# EAGLE board Jonah-ar PANEL - LCD-midi (EAGLE 6.4), part 1 of 2
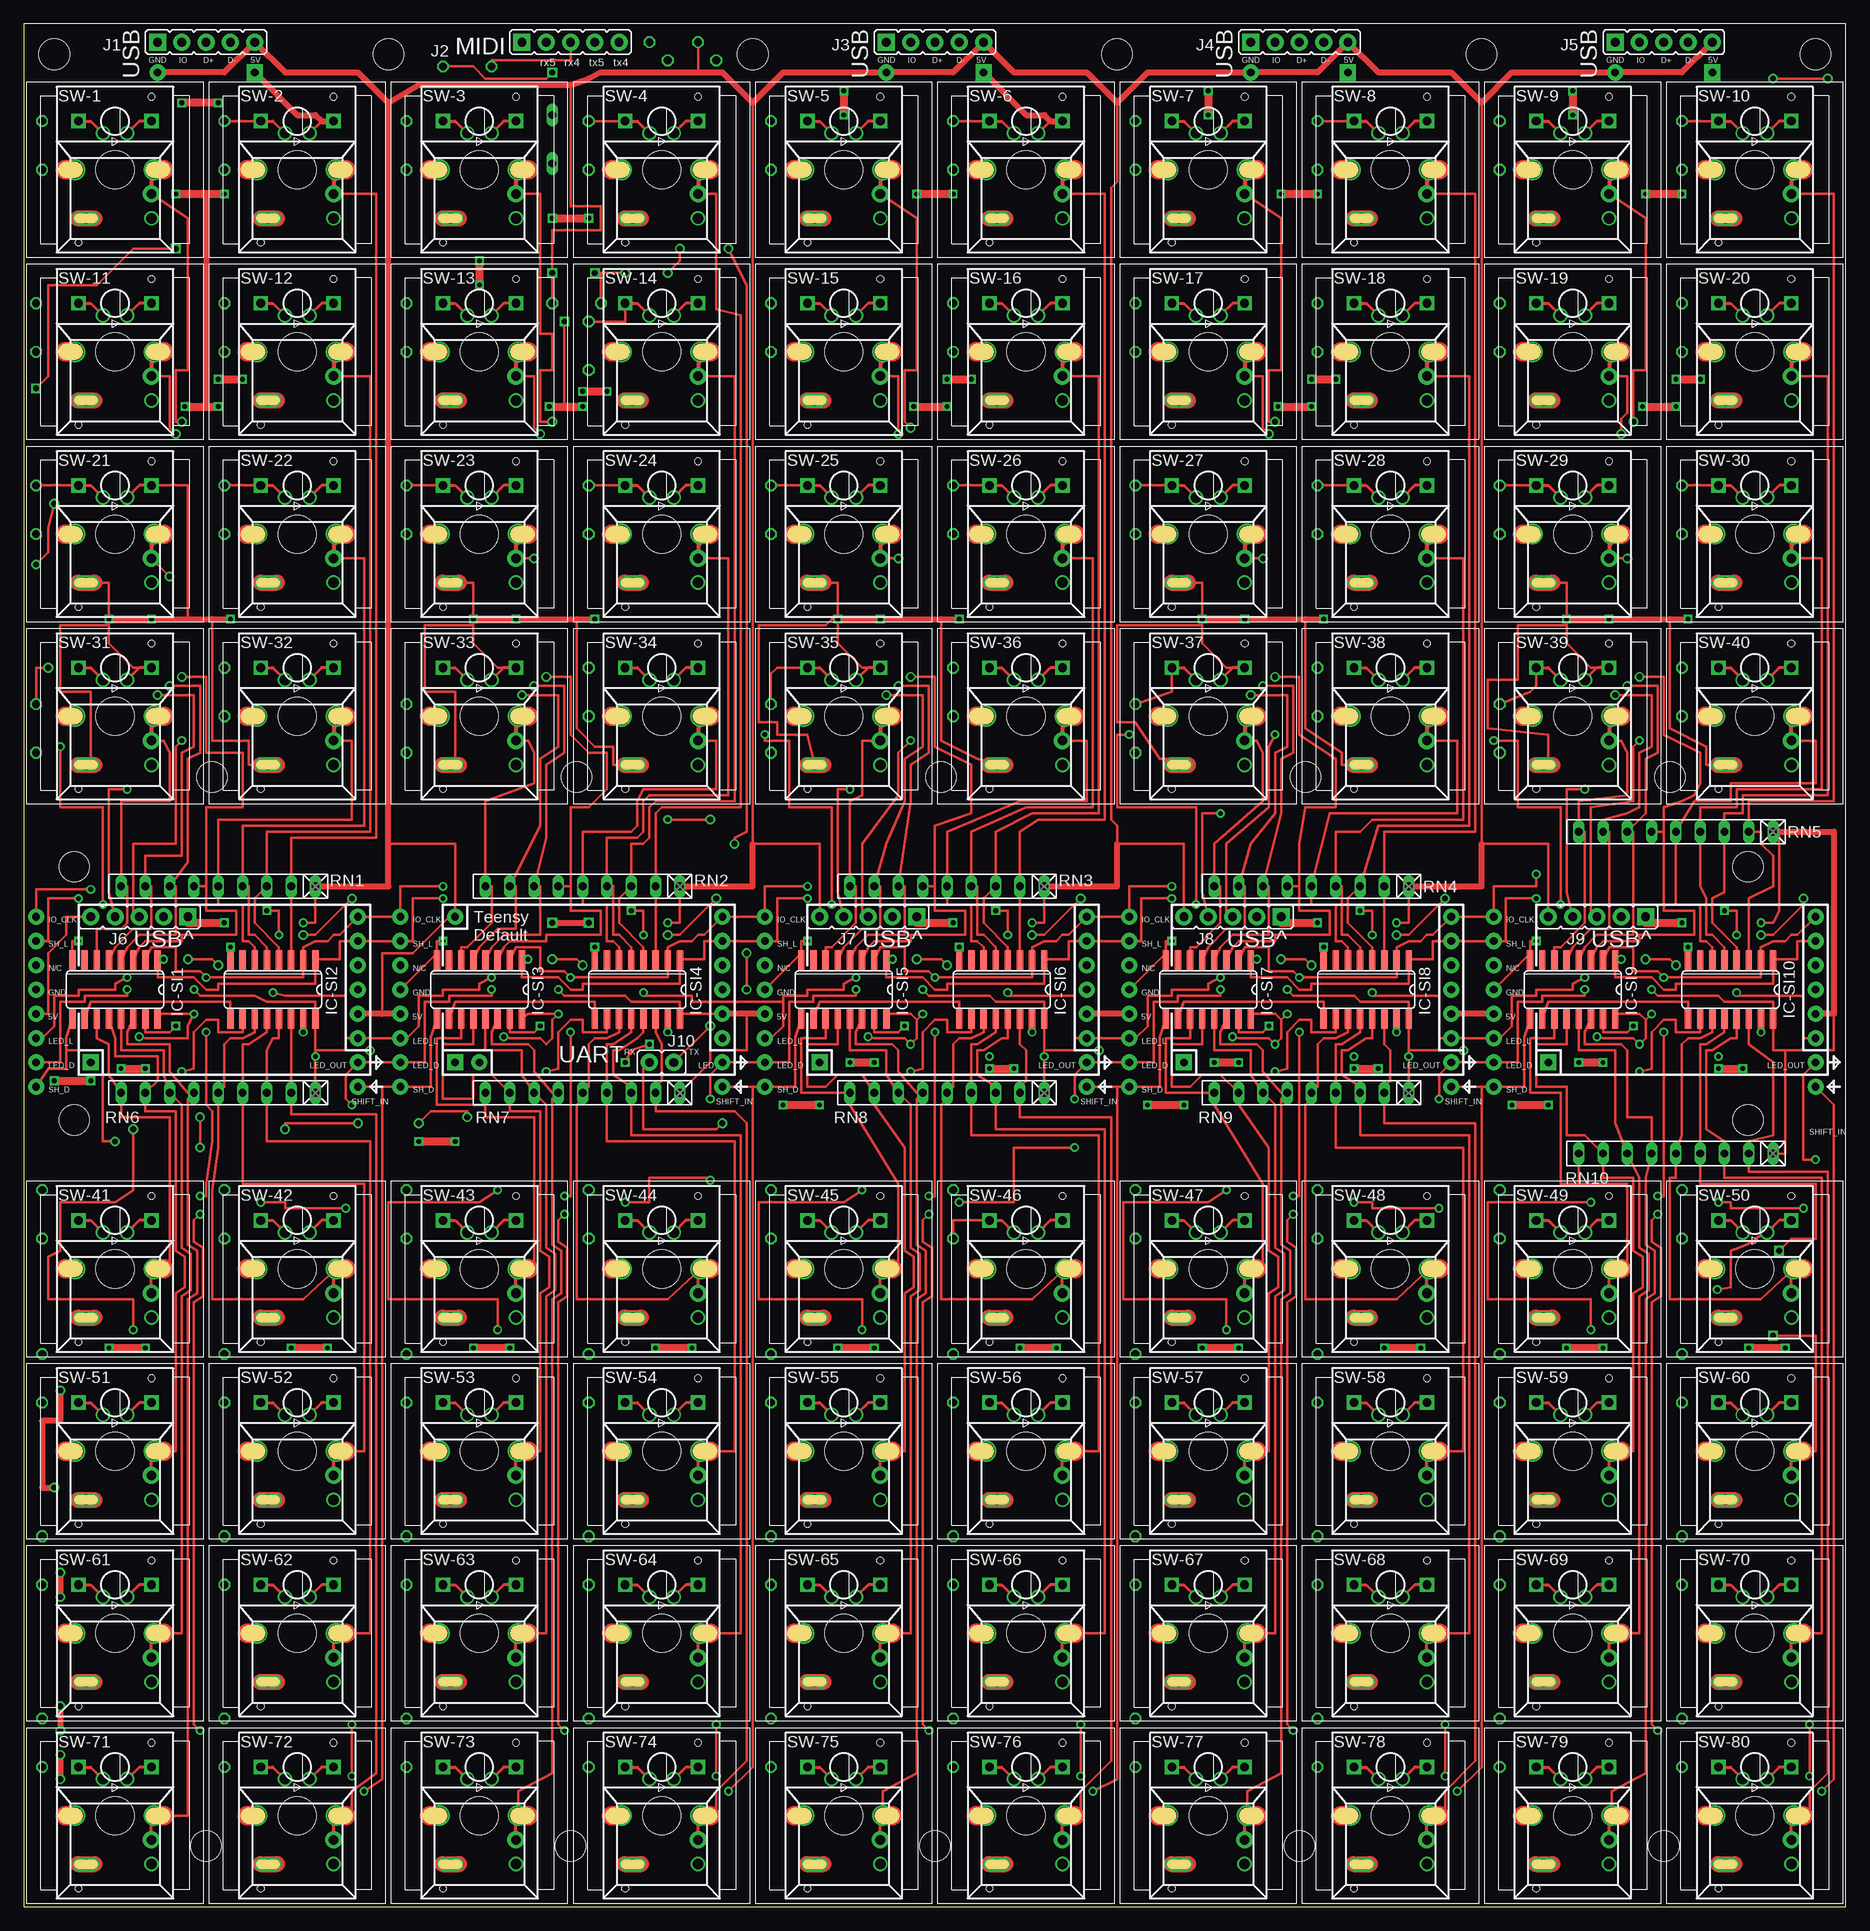
[diagram p4: board, top side]
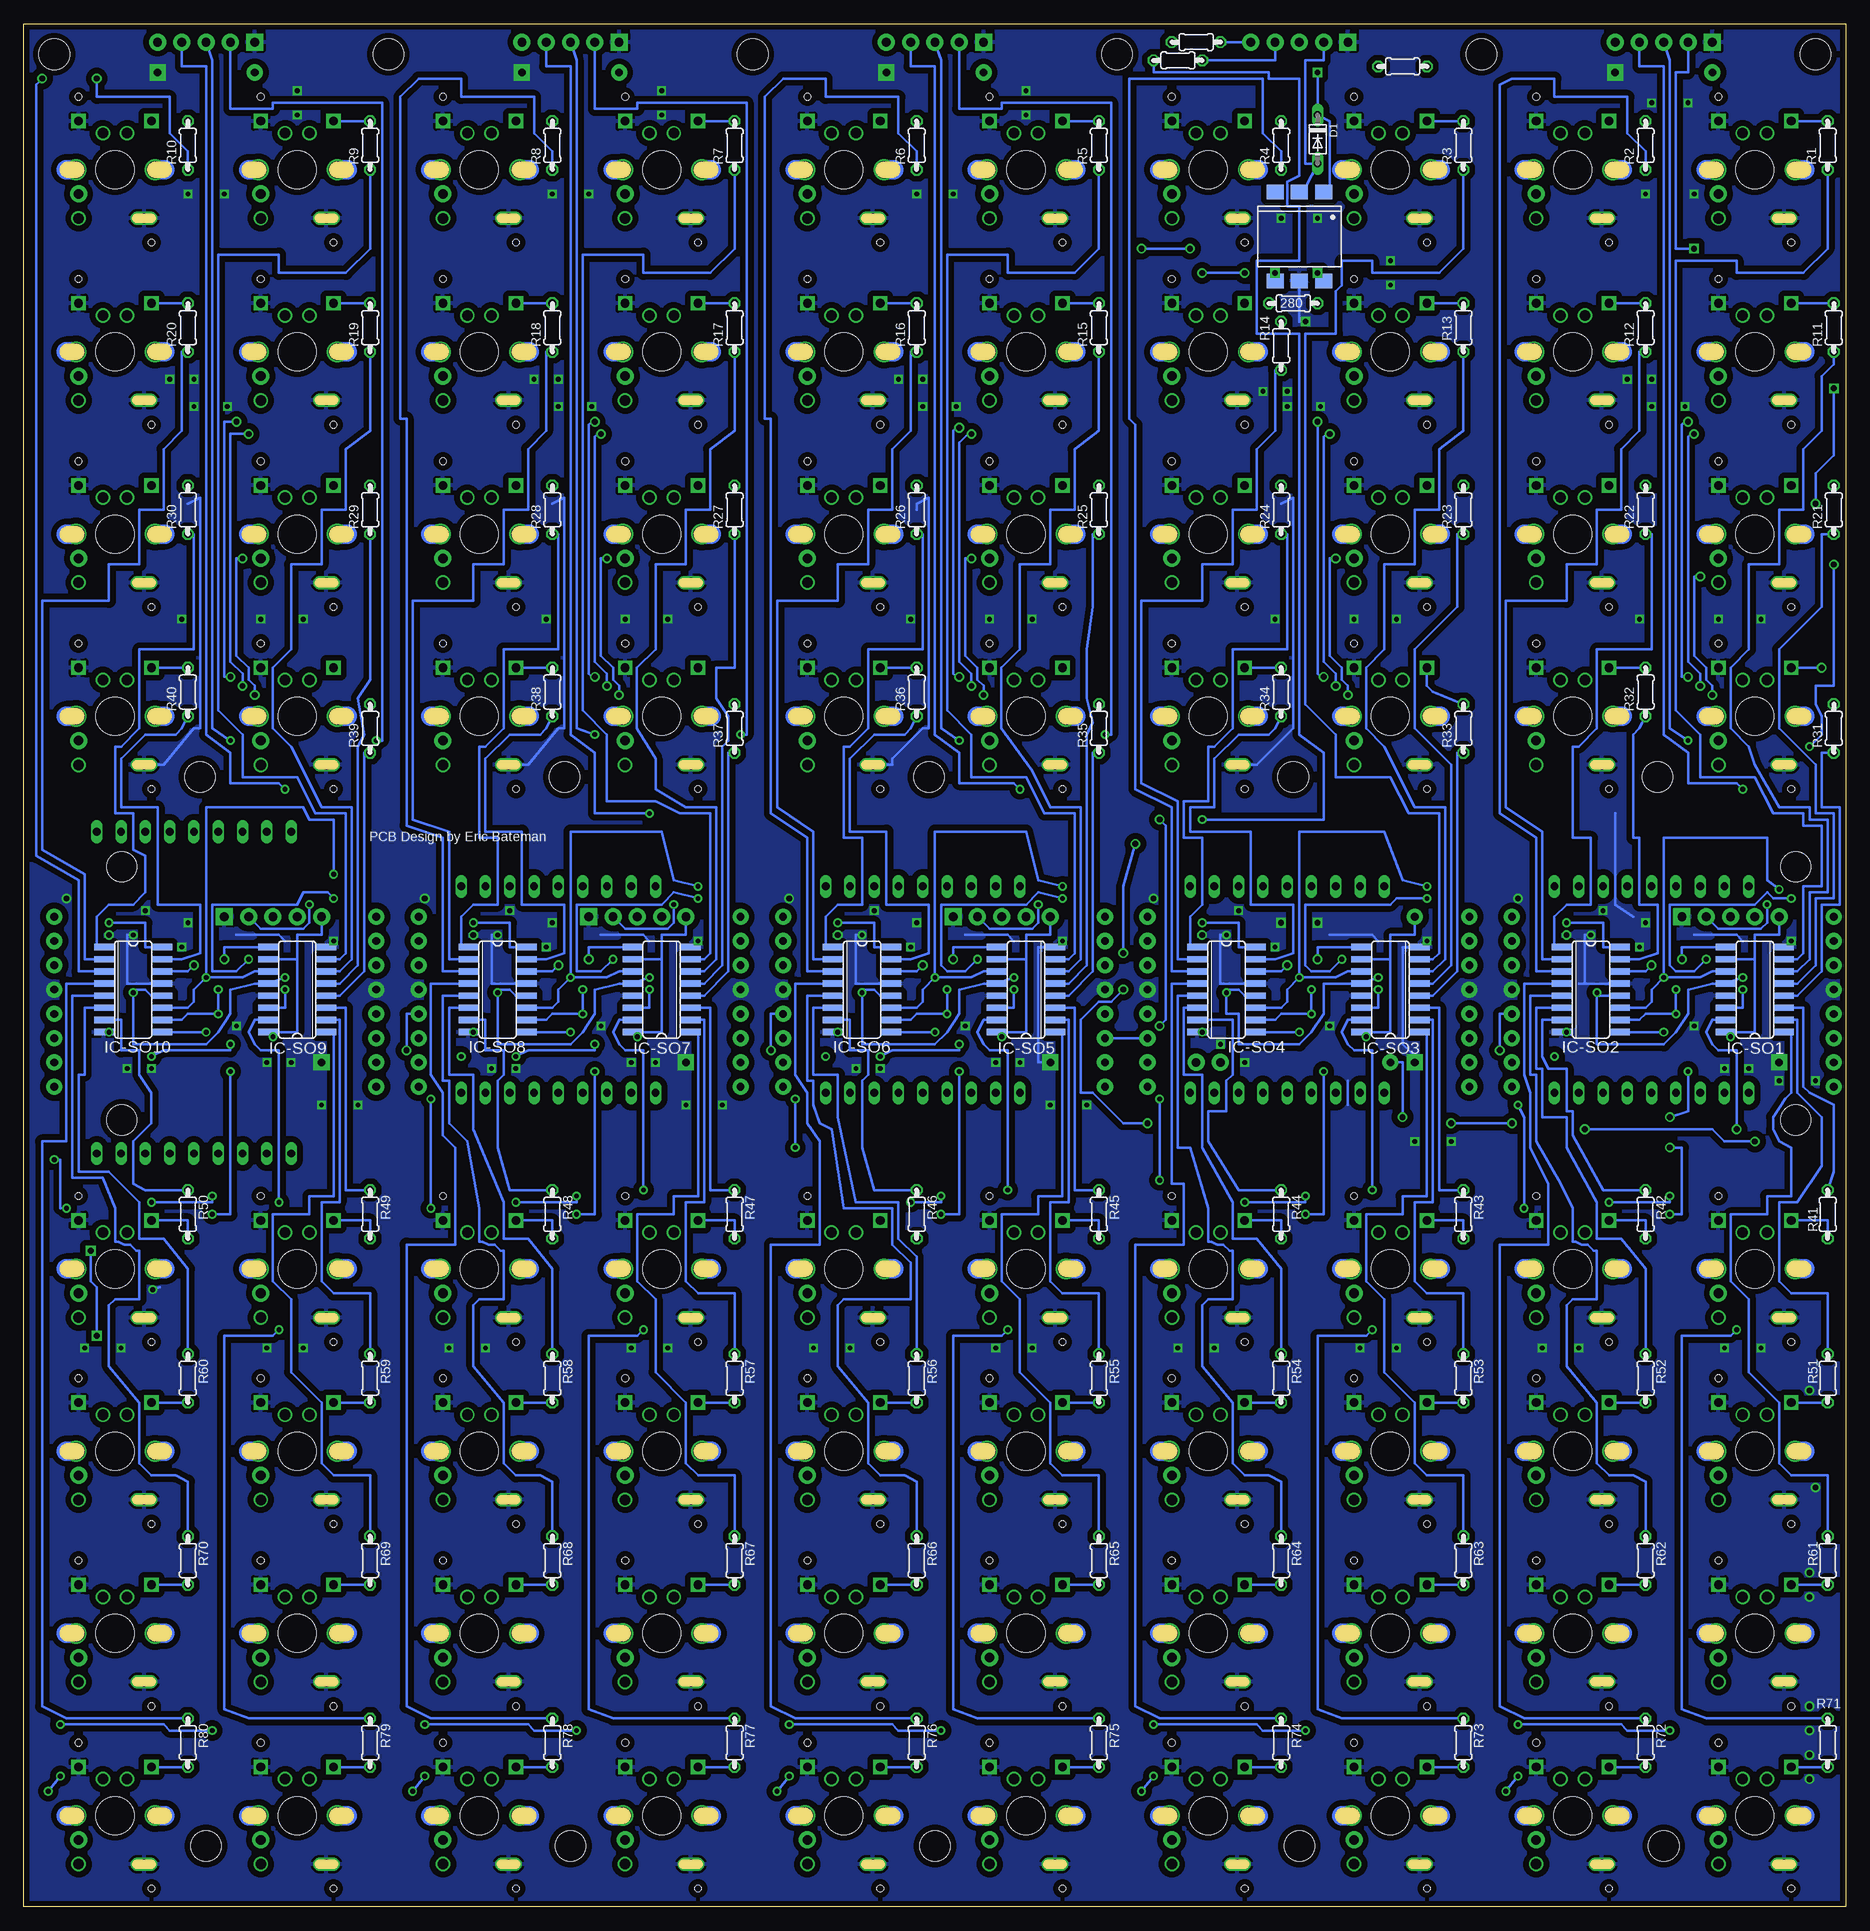
[diagram p5: board, bottom side, seen from below]

Size 190.5 x 196.85 mm. Coordinates in mm from the lower left corner, seen from the top.
Outline: 0,0 190.5,0 190.5,196.85 0,196.85 0,0
Copper layers (1*16): Top 0.035mm / dielectric 1.5mm / Bottom 0.035mm
Design rules "default *": minimum track width 10mil, minimum drill 8mil, track to track 5mil, track to pad 8mil, pad to pad 8mil, via to via 8mil, smd to smd 8mil, copper to edge 8mil, drill to drill 6mil, minimum pad ring 8mil, minimum via ring 8mil, stop-mask expansion 0mil, vias tented up to drill 0mil, thermal gap 10mil
Holes 3.2 mm at 19.05,6.35 19.68,118.11 3.17,193.68 38.1,193.68 57.15,6.35 57.78,118.11 76.2,193.68 95.25,6.35 114.3,193.68 133.35,6.35 133.99,118.11 152.4,193.68 171.45,6.35 172.09,118.11 187.32,193.68 95.89,118.11
Holes 3.17 mm at 5.26,108.74 5.26,82.25 180.26,82.25 180.26,108.74

## Footprints (pad centres in the part's own frame; a part is rotated, then mirrored left to right if it is on the bottom)
0204/5 = drill 0.813 octagon: 1 -2.54,0; 2 2.54,0
DO34-5 = drill 0.813 long: A 2.54,0; C -2.54,0
SO16 = smd 0.66 x 2.032: 1 -4.445,-3.073; 2 -3.175,-3.073; 3 -1.905,-3.073; 4 -0.635,-3.073; 5 0.635,-3.073; 6 1.905,-3.073; 7 3.175,-3.073; 8 4.445,-3.073; 9 4.445,3.073; 10 3.175,3.073; 11 1.905,3.073; 12 0.635,3.073; 13 -0.635,3.073; 14 -1.905,3.073; 15 -3.175,3.073; 16 -4.445,3.073
JP5 = drill 0.914 pad 1.778 square: 1 0,0 | drill 0.914 pad 1.778: 2 2.54,0; 3 5.08,0; 4 7.62,0; 5 10.16,0
JP1 = drill 0.914 pad 1.778: 1 0,-1.27; 2 0,1.27
DIL6-SMD = smd 1.78 x 1.52: 1 -2.54,-4.645; 2 0,-4.645; 3 2.54,-4.645; 4 2.54,4.645; 5 0,4.645; 6 -2.54,4.645
RN-9 = drill 0.813 long: 1 -10.16,0; 2 -7.62,0; 3 -5.08,0; 4 -2.54,0; 5 0,0; 6 2.54,0; 7 5.08,0; 8 7.62,0; 9 10.16,0
CHERRY-MX-LED = drill 0.9 pad 1.5 square: L+ -3.81,5.08; L- 3.81,5.08 | drill 1.1: P$1 -1.27,3.81; P$4 1.27,3.81; P$5 3.81,-5.08 | drill 1 pad 1.778: P$2 3.81,-2.54 | drill 1.753 pad 2.032: P$3 -4.191,0; SA 4.064,0 | drill 1 long: SB -3.048,-5.08 | hole 3.988: 0,0 | hole 0.7: 3.81,7.62; -3.81,-7.62

## Placement (x,y rotation side)
280  280  [0204/5]  57.78,167.64 0 bottom
D1  IN914  [DO34-5]  55.24,184.78 270 bottom
IC-SI1  74LS165-PD  [SO16]  9.53,95.89 180 top
IC-SI2  74LS165-PD  [SO16]  26.04,95.89 180 top
IC-SI3  74LS165-PD  [SO16]  47.62,95.89 180 top
IC-SI4  74LS165-PD  [SO16]  64.14,95.89 180 top
IC-SI5  74LS165-PD  [SO16]  85.72,95.89 180 top
IC-SI6  74LS165-PD  [SO16]  102.23,95.89 180 top
IC-SI7  74LS165-PD  [SO16]  123.83,95.89 180 top
IC-SI8  74LS165-PD  [SO16]  140.34,95.89 180 top
IC-SI9  74LS165-PD  [SO16]  161.93,95.89 180 top
IC-SI10  74LS165-PD  [SO16]  178.44,95.89 180 top
IC-SO1  74LS595D  [SO16]  9.53,95.89 90 bottom
IC-SO2  74LS595D  [SO16]  26.67,95.89 270 bottom
IC-SO3  74LS595D  [SO16]  47.62,95.89 90 bottom
IC-SO4  74LS595D  [SO16]  64.77,95.89 270 bottom
IC-SO5  74LS595D  [SO16]  85.72,95.89 90 bottom
IC-SO6  74LS595D  [SO16]  102.87,95.89 270 bottom
IC-SO7  74LS595D  [SO16]  123.83,95.89 90 bottom
IC-SO8  74LS595D  [SO16]  140.97,95.89 270 bottom
IC-SO9  74LS595D  [SO16]  161.93,95.89 90 bottom
IC-SO10  74LS595D  [SO16]  179.07,95.89 270 bottom
J1  JP5E  [JP5]  13.97,194.94 0 top
J2  JP5E  [JP5]  52.07,194.94 0 top
J3  JP5E  [JP5]  90.17,194.94 0 top
J4  JP5E  [JP5]  128.27,194.94 0 top
J5  JP5E  [JP5]  166.37,194.94 0 top
J6  JP5E  [JP5]  17.14,103.5 180 top
J7  JP5E  [JP5]  93.34,103.5 180 top
J8  JP5E  [JP5]  131.44,103.5 180 top
J9  JP5E  [JP5]  169.54,103.5 180 top
J10  [JP1]  66.67,88.27 270 top
PC900  PC900V  [DIL6-SMD]  57.15,174.62 180 bottom
R1  [0204/5]  1.91,184.15 90 bottom
R2  [0204/5]  20.95,184.15 90 bottom
R3  [0204/5]  40.01,184.15 90 bottom
R4  [0204/5]  59.05,184.15 90 bottom
R5  [0204/5]  78.11,184.15 90 bottom
R6  [0204/5]  97.16,184.15 90 bottom
R7  [0204/5]  116.2,184.15 90 bottom
R8  [0204/5]  135.25,184.15 90 bottom
R9  [0204/5]  154.31,184.15 90 bottom
R10  [0204/5]  173.35,184.15 90 bottom
R11  [0204/5]  1.27,165.1 90 bottom
R12  [0204/5]  20.95,165.1 90 bottom
R13  [0204/5]  40.01,165.1 90 bottom
R14  [0204/5]  59.05,163.19 90 bottom
R15  [0204/5]  78.11,165.1 90 bottom
R16  [0204/5]  97.16,165.1 90 bottom
R17  [0204/5]  116.2,165.1 90 bottom
R18  [0204/5]  135.25,165.1 90 bottom
R19  [0204/5]  154.31,165.1 90 bottom
R20  [0204/5]  173.35,165.1 90 bottom
R21  [0204/5]  1.27,146.05 90 bottom
R22  [0204/5]  20.95,146.05 90 bottom
R23  [0204/5]  40.01,146.05 90 bottom
R24  [0204/5]  59.05,146.05 90 bottom
R25  [0204/5]  78.11,146.05 90 bottom
R26  [0204/5]  97.16,146.05 90 bottom
R27  [0204/5]  116.2,146.05 90 bottom
R28  [0204/5]  135.25,146.05 90 bottom
R29  [0204/5]  154.31,146.05 90 bottom
R30  [0204/5]  173.35,146.05 90 bottom
R31  [0204/5]  1.27,123.19 90 bottom
R32  [0204/5]  20.95,127 90 bottom
R33  [0204/5]  40.01,123.19 90 bottom
R34  [0204/5]  59.05,127 90 bottom
R35  [0204/5]  78.11,123.19 90 bottom
R36  [0204/5]  97.16,127 90 bottom
R37  [0204/5]  116.2,123.19 90 bottom
R38  [0204/5]  135.25,127 90 bottom
R39  [0204/5]  154.31,123.19 90 bottom
R40  [0204/5]  173.35,127 90 bottom
R41  [0204/5]  1.91,72.39 270 bottom
R42  [0204/5]  20.95,72.39 270 bottom
R43  [0204/5]  40.01,72.39 270 bottom
R44  [0204/5]  59.05,72.39 270 bottom
R45  [0204/5]  78.11,72.39 270 bottom
R46  [0204/5]  97.16,72.39 270 bottom
R47  [0204/5]  116.2,72.39 270 bottom
R48  [0204/5]  135.25,72.39 270 bottom
R49  [0204/5]  154.31,72.39 270 bottom
R50  [0204/5]  173.35,72.39 270 bottom
R51  [0204/5]  1.91,55.24 270 bottom
R52  [0204/5]  20.95,55.24 270 bottom
R53  [0204/5]  40.01,55.24 270 bottom
R54  [0204/5]  59.05,55.24 270 bottom
R55  [0204/5]  78.11,55.24 270 bottom
R56  [0204/5]  97.16,55.24 270 bottom
R57  [0204/5]  116.2,55.24 270 bottom
R58  [0204/5]  135.25,55.24 270 bottom
R59  [0204/5]  154.31,55.24 270 bottom
R60  [0204/5]  173.35,55.24 270 bottom
R61  [0204/5]  1.91,36.2 270 bottom
R62  [0204/5]  20.95,36.2 270 bottom
R63  [0204/5]  40.01,36.2 270 bottom
R64  [0204/5]  59.05,36.2 270 bottom
R65  [0204/5]  78.11,36.2 270 bottom
R66  [0204/5]  97.16,36.2 270 bottom
R67  [0204/5]  116.2,36.2 270 bottom
R68  [0204/5]  135.25,36.2 270 bottom
R69  [0204/5]  154.31,36.2 270 bottom
R70  [0204/5]  173.35,36.2 270 bottom
R71  [0204/5]  1.91,17.14 270 bottom
R72  [0204/5]  20.95,17.14 270 bottom
R73  [0204/5]  40.01,17.14 270 bottom
R74  [0204/5]  59.05,17.14 270 bottom
R75  [0204/5]  78.11,17.14 270 bottom
R76  [0204/5]  97.16,17.14 270 bottom
R77  [0204/5]  116.2,17.14 270 bottom
R78  [0204/5]  135.25,17.14 270 bottom
R79  [0204/5]  154.31,17.14 270 bottom
R80  [0204/5]  173.35,17.14 270 bottom
RN1  10K  [RN-9]  20.32,106.68 180 top
RN2  10K  [RN-9]  58.42,106.68 180 top
RN3  10K  [RN-9]  96.52,106.68 180 top
RN4  10K  [RN-9]  134.62,106.68 180 top
RN5  10K  [RN-9]  172.72,112.39 180 top
RN6  10K  [RN-9]  20.32,85.09 180 top
RN7  10K  [RN-9]  58.42,85.09 180 top
RN8  10K  [RN-9]  96.52,85.09 180 top
RN9  10K  [RN-9]  134.62,85.09 180 top
RN10  10K  [RN-9]  172.72,78.74 180 top
RX_220  220  [0204/5]  46.35,192.41 180 bottom
SW-1  CHERRY-MX-LED  [CHERRY-MX-LED]  9.53,181.61 0 top
SW-2  CHERRY-MX-LED  [CHERRY-MX-LED]  28.57,181.61 0 top
SW-3  CHERRY-MX-LED  [CHERRY-MX-LED]  47.62,181.61 0 top
SW-4  CHERRY-MX-LED  [CHERRY-MX-LED]  66.67,181.61 0 top
SW-5  CHERRY-MX-LED  [CHERRY-MX-LED]  85.72,181.61 0 top
SW-6  CHERRY-MX-LED  [CHERRY-MX-LED]  104.78,181.61 0 top
SW-7  CHERRY-MX-LED  [CHERRY-MX-LED]  123.83,181.61 0 top
SW-8  CHERRY-MX-LED  [CHERRY-MX-LED]  142.88,181.61 0 top
SW-9  CHERRY-MX-LED  [CHERRY-MX-LED]  161.93,181.61 0 top
SW-10  CHERRY-MX-LED  [CHERRY-MX-LED]  180.97,181.61 0 top
SW-11  CHERRY-MX-LED  [CHERRY-MX-LED]  9.53,162.56 0 top
SW-12  CHERRY-MX-LED  [CHERRY-MX-LED]  28.57,162.56 0 top
SW-13  CHERRY-MX-LED  [CHERRY-MX-LED]  47.62,162.56 0 top
SW-14  CHERRY-MX-LED  [CHERRY-MX-LED]  66.67,162.56 0 top
SW-15  CHERRY-MX-LED  [CHERRY-MX-LED]  85.72,162.56 0 top
SW-16  CHERRY-MX-LED  [CHERRY-MX-LED]  104.78,162.56 0 top
SW-17  CHERRY-MX-LED  [CHERRY-MX-LED]  123.83,162.56 0 top
SW-18  CHERRY-MX-LED  [CHERRY-MX-LED]  142.88,162.56 0 top
SW-19  CHERRY-MX-LED  [CHERRY-MX-LED]  161.93,162.56 0 top
SW-20  CHERRY-MX-LED  [CHERRY-MX-LED]  180.97,162.56 0 top
SW-21  CHERRY-MX-LED  [CHERRY-MX-LED]  9.53,143.51 0 top
SW-22  CHERRY-MX-LED  [CHERRY-MX-LED]  28.57,143.51 0 top
SW-23  CHERRY-MX-LED  [CHERRY-MX-LED]  47.62,143.51 0 top
SW-24  CHERRY-MX-LED  [CHERRY-MX-LED]  66.67,143.51 0 top
SW-25  CHERRY-MX-LED  [CHERRY-MX-LED]  85.72,143.51 0 top
SW-26  CHERRY-MX-LED  [CHERRY-MX-LED]  104.78,143.51 0 top
SW-27  CHERRY-MX-LED  [CHERRY-MX-LED]  123.83,143.51 0 top
SW-28  CHERRY-MX-LED  [CHERRY-MX-LED]  142.88,143.51 0 top
SW-29  CHERRY-MX-LED  [CHERRY-MX-LED]  161.93,143.51 0 top
SW-30  CHERRY-MX-LED  [CHERRY-MX-LED]  180.97,143.51 0 top
SW-31  CHERRY-MX-LED  [CHERRY-MX-LED]  9.53,124.46 0 top
SW-32  CHERRY-MX-LED  [CHERRY-MX-LED]  28.57,124.46 0 top
SW-33  CHERRY-MX-LED  [CHERRY-MX-LED]  47.62,124.46 0 top
SW-34  CHERRY-MX-LED  [CHERRY-MX-LED]  66.67,124.46 0 top
SW-35  CHERRY-MX-LED  [CHERRY-MX-LED]  85.72,124.46 0 top
SW-36  CHERRY-MX-LED  [CHERRY-MX-LED]  104.78,124.46 0 top
SW-37  CHERRY-MX-LED  [CHERRY-MX-LED]  123.83,124.46 0 top
SW-38  CHERRY-MX-LED  [CHERRY-MX-LED]  142.88,124.46 0 top
SW-39  CHERRY-MX-LED  [CHERRY-MX-LED]  161.93,124.46 0 top
SW-40  CHERRY-MX-LED  [CHERRY-MX-LED]  180.97,124.46 0 top
SW-41  CHERRY-MX-LED  [CHERRY-MX-LED]  9.53,66.67 0 top
SW-42  CHERRY-MX-LED  [CHERRY-MX-LED]  28.57,66.67 0 top
SW-43  CHERRY-MX-LED  [CHERRY-MX-LED]  47.62,66.67 0 top
SW-44  CHERRY-MX-LED  [CHERRY-MX-LED]  66.67,66.67 0 top
SW-45  CHERRY-MX-LED  [CHERRY-MX-LED]  85.72,66.67 0 top
SW-46  CHERRY-MX-LED  [CHERRY-MX-LED]  104.78,66.67 0 top
SW-47  CHERRY-MX-LED  [CHERRY-MX-LED]  123.83,66.67 0 top
SW-48  CHERRY-MX-LED  [CHERRY-MX-LED]  142.88,66.67 0 top
SW-49  CHERRY-MX-LED  [CHERRY-MX-LED]  161.93,66.67 0 top
SW-50  CHERRY-MX-LED  [CHERRY-MX-LED]  180.97,66.67 0 top
SW-51  CHERRY-MX-LED  [CHERRY-MX-LED]  9.53,47.62 0 top
SW-52  CHERRY-MX-LED  [CHERRY-MX-LED]  28.57,47.62 0 top
SW-53  CHERRY-MX-LED  [CHERRY-MX-LED]  47.62,47.62 0 top
SW-54  CHERRY-MX-LED  [CHERRY-MX-LED]  66.67,47.62 0 top
SW-55  CHERRY-MX-LED  [CHERRY-MX-LED]  85.72,47.62 0 top
SW-56  CHERRY-MX-LED  [CHERRY-MX-LED]  104.78,47.62 0 top
SW-57  CHERRY-MX-LED  [CHERRY-MX-LED]  123.83,47.62 0 top
SW-58  CHERRY-MX-LED  [CHERRY-MX-LED]  142.88,47.62 0 top
SW-59  CHERRY-MX-LED  [CHERRY-MX-LED]  161.93,47.62 0 top
SW-60  CHERRY-MX-LED  [CHERRY-MX-LED]  180.97,47.62 0 top
SW-61  CHERRY-MX-LED  [CHERRY-MX-LED]  9.53,28.57 0 top
SW-62  CHERRY-MX-LED  [CHERRY-MX-LED]  28.57,28.57 0 top
SW-63  CHERRY-MX-LED  [CHERRY-MX-LED]  47.62,28.57 0 top
SW-64  CHERRY-MX-LED  [CHERRY-MX-LED]  66.67,28.57 0 top
SW-65  CHERRY-MX-LED  [CHERRY-MX-LED]  85.72,28.57 0 top
SW-66  CHERRY-MX-LED  [CHERRY-MX-LED]  104.78,28.57 0 top
SW-67  CHERRY-MX-LED  [CHERRY-MX-LED]  123.83,28.57 0 top
SW-68  CHERRY-MX-LED  [CHERRY-MX-LED]  142.88,28.57 0 top
SW-69  CHERRY-MX-LED  [CHERRY-MX-LED]  161.93,28.57 0 top
SW-70  CHERRY-MX-LED  [CHERRY-MX-LED]  180.97,28.57 0 top
SW-71  CHERRY-MX-LED  [CHERRY-MX-LED]  9.53,9.53 0 top
SW-72  CHERRY-MX-LED  [CHERRY-MX-LED]  28.57,9.53 0 top
SW-73  CHERRY-MX-LED  [CHERRY-MX-LED]  47.62,9.53 0 top
SW-74  CHERRY-MX-LED  [CHERRY-MX-LED]  66.67,9.53 0 top
SW-75  CHERRY-MX-LED  [CHERRY-MX-LED]  85.72,9.53 0 top
SW-76  CHERRY-MX-LED  [CHERRY-MX-LED]  104.78,9.53 0 top
SW-77  CHERRY-MX-LED  [CHERRY-MX-LED]  123.83,9.53 0 top
SW-78  CHERRY-MX-LED  [CHERRY-MX-LED]  142.88,9.53 0 top
SW-79  CHERRY-MX-LED  [CHERRY-MX-LED]  161.93,9.53 0 top
SW-80  CHERRY-MX-LED  [CHERRY-MX-LED]  180.97,9.53 0 top
TX_220_1  220  [0204/5]  67.94,194.94 180 bottom
TX_220_2  220  [0204/5]  69.85,193.04 0 bottom

## Tracks (layer width: path | path; a pad name or v marks a point on that pad's centre or on a via)
900V_1  (via drill 0.6)
  Top 0.254: RX_220.1 46.99,192.41 48.26,191.13 54.61,191.13 v55.24,191.77
  Bottom 0.254: v55.24,191.77 D1.C 53.98,186.69 53.98,179.71 54.61,179.07 PC900.1
+5V  (via drill 0.5 pad 0.25, 0.6, 0.8 pad 1.68)
  Top 0.254: v36.2,89.53 30.48,89.53 v30.48,88.9 | v112.39,89.53 106.68,89.53 v106.68,88.9 | v150.5,89.53 144.78,89.53 v144.78,88.9 | 76.2,188.59 76.2,111.12 83.19,111.12 J7.5 | 114.3,188.59 114.3,180.34 113.67,179.71 113.67,113.67 114.3,113.03 114.3,111.12 121.28,111.12 J8.5 | 152.4,188.59 152.4,111.12 159.38,111.12 J9.5 | 38.1,111.12 45.09,111.12 v45.09,103.5 44.45,103.5 40.64,99.69 37.47,99.69 37.47,93.34 | RN4.1 144.78,102.87 v143.51,102.87 | 183.51,112.39 183.51,104.14 182.88,102.87 v181.61,102.87 | RN3.1 106.68,102.87 v105.41,102.87 | RN2.1 68.58,102.87 v67.31,102.87 | RN1.1 30.48,102.87 v29.21,102.87 | v1.27,93.34 2.54,93.34 2.54,99.69 4.45,101.6 4.45,103.5 J6.5 | 189.23,93.34 189.23,89.53 184.15,89.53 | RN10.1 184.15,78.74 184.15,89.53 | RN9.1 v144.78,88.9 | RN8.1 v106.68,88.9 | RN7.1 71.75,88.27 71.75,89.53 75.56,89.53 75.56,93.34 | RN6.1 v30.48,88.9 | v12.06,90.96 12.7,90.81 17.14,90.81 17.14,92.08 v17.78,93.34 13.97,93.34 IC-SI1.16 | IC-SI3.16 52.7,93.34 v55.88,93.34 55.24,92.71 55.24,90.81 54.61,90.17 53.98,90.81 50.8,90.81 v50.16,90.96 | 93.34,92.71 93.34,90.81 v92.71,90.17 92.08,90.81 88.9,90.81 v88.27,90.96 | 93.34,92.71 v93.98,93.34 | 93.34,92.71 92.71,93.34 90.17,93.34 IC-SI5.16 | 131.44,92.71 131.44,90.81 v130.81,90.17 130.18,90.81 127,90.81 v126.36,90.96 | 131.44,92.71 v132.08,93.34 | 131.44,92.71 130.81,93.34 128.27,93.34 IC-SI7.16 | 169.54,92.71 169.54,90.81 v168.91,90.17 168.28,90.81 165.1,90.81 v164.47,90.96 | 169.54,92.71 v170.18,93.34 | 169.54,92.71 168.91,93.34 166.37,93.34 IC-SI9.16 | v170.18,95.89 170.81,95.25 177.16,95.25 177.8,94.61 182.88,94.61 IC-SI10.16 182.88,89.53 184.15,89.53
  Top 0.254: v17.78,95.89 18.41,95.25 24.13,95.25 25.4,94.61 30.48,94.61 IC-SI2.16 v30.48,88.9 | v144.78,88.9 IC-SI8.16 144.78,94.61 139.7,94.61 139.06,95.25 132.72,95.25 v132.08,95.89 | v106.68,88.9 IC-SI6.16 106.68,94.61 101.6,94.61 100.97,95.25 94.61,95.25 v93.98,95.89 | 74.3,93.34 68.58,93.34 IC-SI4.16 68.58,94.61 63.5,94.61 62.87,95.25 56.52,95.25 v55.88,95.89 | 70.48,191.77 TX_220_1.2 | 57.15,190.5 57.15,177.8 60.33,177.8 60.33,175.26 55.24,175.26 v55.24,170.81 280.2
  Top 0.61: v13.97,191.77 20.95,191.77 J1.5 27.3,191.77 34.92,191.77 38.1,188.59 | 38.1,188.59 41.27,190.5 57.15,190.5 59.05,191.13 60.33,191.77 70.48,191.77 73.03,191.77 76.2,188.59 79.38,191.77 v90.17,191.77 97.16,191.77 J3.5 103.5,191.77 111.12,191.77 114.3,188.59 117.47,191.77 v128.27,191.77 135.25,191.77 J4.5 141.6,191.77 149.22,191.77 152.4,188.59 155.57,191.77 v166.37,191.77 173.35,191.77 J5.5 | RN1.1 38.1,106.68 38.1,111.12 38.1,188.59 | RN2.1 76.2,106.68 76.2,111.12 | RN3.1 114.3,106.68 114.3,111.12 | RN4.1 152.4,106.68 152.4,111.12 | v39.37,93.34 37.47,93.34 v34.92,93.34 | v77.47,93.34 75.56,93.34 74.3,93.34 v73.03,93.34 | v115.57,93.34 v111.12,93.34 | v153.67,93.34 v149.22,93.34 | RN5.1 183.51,112.39 189.23,112.39 189.23,93.34 v187.32,93.34
  Bottom 0.254: v17.78,95.89 v17.78,93.34 20.95,93.34 21.59,92.71 IC-SO2.10 | IC-SO2.16 25.4,100.33 25.4,102.87 v29.21,102.87 | IC-SO1.16 v12.06,90.96 11.43,91.44 9.53,91.44 9.53,99.06 | IC-SO1.10 9.53,99.06 | v92.71,90.17 92.71,89.53 99.69,89.53 v100.97,88.9 | IC-SO6.16 101.6,100.33 101.6,102.87 v105.41,102.87 | IC-SO5.16 v88.27,90.96 87.63,91.44 85.72,91.44 85.72,99.06 | IC-SO5.10 85.72,99.06 | IC-SO6.10 97.79,92.71 97.16,93.34 v93.98,93.34 v93.98,95.89 | IC-SO4.16 63.5,100.33 63.5,102.87 v67.31,102.87 | IC-SO3.16 v50.16,90.96 49.53,91.44 47.62,91.44 47.62,99.06 | IC-SO3.10 47.62,99.06 | IC-SO4.10 59.69,92.71 59.05,93.34 v55.88,93.34 v55.88,95.89 | v130.81,90.17 130.81,89.53 137.79,89.53 v139.06,88.9 | IC-SO8.16 139.7,100.33 139.7,102.87 v143.51,102.87 | IC-SO7.16 v126.36,90.96 125.73,91.44 123.83,91.44 123.83,99.06 | IC-SO7.10 123.83,99.06 | IC-SO8.10 135.89,92.71 135.25,93.34 v132.08,93.34 v132.08,95.89 | v168.91,90.17 168.91,89.53 175.9,89.53 v177.16,88.9 | v170.18,95.89 v170.18,93.34 173.35,93.34 173.99,92.71 IC-SO10.10 | IC-SO10.16 177.8,100.33 177.8,102.87 v181.61,102.87 | IC-SO9.16 v164.47,90.96 163.83,91.44 161.93,91.44 161.93,99.06 | IC-SO9.10 161.93,99.06 | v36.2,89.53 36.2,93.34 v34.92,93.34 | v112.39,89.53 112.39,93.34 v111.12,93.34 | v150.5,89.53 150.5,93.34 v149.22,93.34 | J6.5 6.99,101.6 9.53,101.6 9.53,99.06 | v45.09,103.5 45.09,101.6 47.62,101.6 47.62,99.06 | J7.5 83.19,101.6 85.72,101.6 85.72,99.06 | J8.5 121.28,101.6 123.83,101.6 123.83,99.06 | J9.5 159.38,101.6 161.93,101.6 161.93,99.06 | PC900.6 54.61,170.18 v55.24,170.81
GND  (via drill 0.5, 0.5 pad 0.25, 0.5 pad 0.81, 0.6, 0.8 pad 1.68)
  Top 0.254: IC-SI2.15 v29.21,91.44 | IC-SI1.8 5.08,100.97 v5.71,100.97 | IC-SI2.8 v21.59,100.33 | SW-31.SB 6.99,119.38 6.99,127 3.81,127 3.81,133.99 8.89,133.99 v8.89,134.62 | IC-SI1.15 12.7,91.44 15.24,91.44 v15.88,92.08 | v25.4,104.14 26.67,104.14 v26.67,101.6 | v62.87,88.27 63.5,89.53 v65.41,90.17 | IC-SI4.15 v67.31,91.44 | IC-SI3.8 43.18,99.69 | IC-SI4.8 v59.69,100.33 | SW-33.SB 45.09,119.38 45.09,127 41.91,127 41.91,133.99 46.99,133.99 | IC-SI3.15 50.8,91.44 53.34,91.44 v53.98,92.08 | v63.5,104.14 64.77,104.14 v64.77,101.6 | IC-SI6.15 v105.41,91.44 | IC-SI5.8 81.28,99.69 | IC-SI6.8 v97.79,100.33 | SW-35.SB 81.92,122.56 78.74,122.56 78.74,123.83 76.83,123.83 76.83,133.99 83.82,133.99 84.45,134.62 v85.09,134.62 | IC-SI5.15 88.9,91.44 91.44,91.44 v92.08,92.08 | v101.6,104.14 102.87,104.14 v102.87,101.6 | IC-SI8.15 v143.51,91.44 | IC-SI7.8 119.38,99.69 | IC-SI8.8 v135.89,100.33 | SW-37.SB 120.02,120.02 118.75,120.02 116.2,123.83 114.3,123.83 114.3,133.99 123.19,133.99 v123.19,134.62 | IC-SI7.15 127,91.44 129.54,91.44 v130.18,92.08 | v139.7,104.14 140.97,104.14 v140.97,101.6 | IC-SI10.15 v181.61,91.44 | IC-SI9.8 157.48,99.69 | IC-SI10.8 v173.99,100.33 | SW-39.SB 159.38,119.38 159.38,122.56 153.03,123.19 153.03,128.27 156.21,128.27 156.21,133.99 161.29,133.99 | IC-SI9.15 165.1,91.44 167.64,91.44 v168.28,92.08 | v177.8,104.14 179.07,104.14 v179.07,101.6 | v153.67,95.89 157.48,99.69 | 157.48,99.69 157.48,100.97 v158.12,100.97 | v115.57,95.89 119.38,99.69 | 119.38,99.69 119.38,100.97 v120.02,100.97 | v77.47,95.89 81.28,99.69 | 81.28,99.69 81.28,100.97 v81.92,100.97 | v39.37,95.89 43.18,99.69 | 43.18,99.69 43.18,100.97 v43.81,100.97
  Top 0.254: SW-21.SB 8.89,138.43 v8.89,134.62 | SW-23.SB 46.99,138.43 v46.99,134.62 46.99,133.99 | 81.92,138.43 SW-25.SB 85.09,138.43 v85.09,134.62 | 120.02,138.43 SW-27.SB 123.19,138.43 v123.19,134.62 | 158.12,138.43 SW-29.SB 161.29,138.43 v161.29,134.62 161.29,133.99 | v186.06,105.41 186.06,104.78 182.88,101.6 v181.61,101.6 | v34.29,105.41 30.48,101.6 v29.21,101.6 | v72.39,105.41 68.58,101.6 v67.31,101.6 | v110.49,105.41 106.68,101.6 v105.41,101.6 | v148.59,105.41 144.78,101.6 v143.51,101.6 | SW-39.L- 163.83,129.54 161.29,132.08 161.29,133.99 | SW-37.L- 125.73,129.54 123.19,132.08 v123.19,134.62 | SW-35.L- 87.63,129.54 85.09,132.08 v85.09,134.62 | SW-33.L- 49.53,129.54 46.99,132.08 46.99,133.99 | SW-31.L- 11.43,129.54 8.89,132.08 v8.89,134.62 | SW-32.SB 23.5,119.38 23.5,121.92 19.68,121.92 19.68,134.62 | SW-34.SB 61.59,119.38 61.59,121.28 59.69,121.28 57.78,123.19 57.78,134.62 | SW-36.SB 99.69,120.02 95.89,121.92 95.89,134.62 | SW-38.SB 137.79,119.38 137.79,120.65 133.99,123.19 133.99,134.62 | SW-40.SB 175.9,119.38 175.9,121.28 172.09,123.19 172.09,134.62 | v56.52,165.74 56.52,156.84 | 17.14,134.62 17.14,148.59 SW-21.L- | 182.25,70.48 180.97,69.85 180.97,69.6 180.09,69.22 179.45,68.96 178.44,68.58 178.44,64.77 v177.04,64.52
  Top 0.61: v13.34,134.62 17.14,134.62 19.68,134.62 v21.59,134.62 | v51.44,134.62 57.78,134.62 v59.69,134.62 | v89.53,134.62 95.89,134.62 v97.79,134.62 | v127.64,134.62 133.99,134.62 v135.89,134.62 | v165.74,134.62 172.09,134.62 v173.99,134.62 | v3.81,20.95 v3.81,18.41 | v3.81,15.88 v3.81,13.34 | v3.81,34.92 v3.81,32.38 | v3.81,53.98 3.81,50.8 1.91,50.8 1.91,43.81 v3.17,43.81 | v100.33,191.77 104.78,187.32 106.68,187.32 107.31,186.69 SW-6.L- | v24.13,191.77 28.57,187.32 30.48,187.32 31.11,186.69 SW-2.L- | 19.05,179.07 19.05,156.84 | v55.24,102.87 v59.05,102.87
  Top 0.813: v8.89,58.42 v12.7,58.42 | v27.94,58.42 v31.75,58.42 | v3.17,86.36 v6.99,86.36 | v20.32,188.59 v16.51,188.59 | v8.89,134.62 v13.34,134.62 | v20.32,159.7 v22.86,159.7 | v15.88,179.07 19.05,179.07 v20.95,179.07 | v10.16,87.63 v12.7,87.63 | J6.1 17.14,102.87 v20.95,102.87 | v16.83,156.84 19.05,156.84 v20.32,156.84 | v46.99,58.42 v50.8,58.42 | v66.04,58.42 v69.85,58.42 | v41.27,80.01 v45.09,80.01 | v47.62,172.09 v47.62,169.54 | v46.99,134.62 v51.44,134.62 | v58.42,158.43 v60.96,158.43 | v55.24,176.53 v59.05,176.53 | v54.93,156.84 56.52,156.84 v58.42,156.84 | v85.09,58.42 v88.9,58.42 | v104.14,58.42 v107.95,58.42 | v79.38,83.82 v83.19,83.82 | v85.72,189.87 v85.72,187.32 | v85.09,134.62 v89.53,134.62 | v96.52,159.7 v99.06,159.7 | v93.34,179.07 v97.16,179.07 | v86.36,88.27 v88.9,88.27 | v100.97,87.63 v103.5,87.63 | J7.1 93.34,102.87 v97.16,102.87 | v93.03,156.84 v96.52,156.84 | v123.19,58.42 v127,58.42 | v142.24,58.42 v146.05,58.42 | v117.47,83.82 v121.28,83.82 | v123.83,189.87 v123.83,187.32 | v123.19,134.62 v127.64,134.62 | v134.62,159.7 v137.16,159.7 | v131.44,179.07 v135.25,179.07 | v124.46,88.27 v127,88.27 | v139.06,87.63 v141.6,87.63 | J8.1 131.44,102.87 v135.25,102.87 | v131.13,156.84 v134.62,156.84 | v161.29,58.42 v165.1,58.42 | v180.34,58.42 v184.15,58.42 | v155.57,83.82 v159.38,83.82 | v161.93,189.87 v161.93,187.32 | v161.29,134.62 v165.74,134.62 | v172.72,159.7 v175.26,159.7 | v169.54,179.07 v173.35,179.07 | v162.56,88.27 v165.1,88.27 | v177.16,87.63 v179.71,87.63 | J9.1 169.54,102.87 v173.35,102.87 | v169.23,156.84 v172.72,156.84
  Bottom 0.254: 23.5,96.52 27.3,96.52 | 10.79,100.97 11.43,101.6 15.88,101.6 | 27.3,96.52 27.3,101.6 v26.67,101.6 | 61.59,96.52 65.41,96.52 65.41,101.6 v64.77,101.6 | 48.9,100.97 49.53,101.6 53.98,101.6 | 99.69,96.52 103.5,96.52 103.5,101.6 v102.87,101.6 | 87,100.97 87.63,101.6 92.08,101.6 | 137.79,96.52 141.6,96.52 141.6,101.6 v140.97,101.6 | 125.09,100.97 125.73,101.6 130.18,101.6 | 175.9,96.52 179.71,96.52 179.71,101.6 v179.07,101.6 | 163.19,100.97 163.83,101.6 168.28,101.6 | IC-SO3.8 v43.81,100.97 44.45,100.33 46.35,100.33 46.35,90.17 45.09,88.9 v45.09,88.27 | IC-SO1.8 v5.71,100.97 | IC-SO5.8 v81.92,100.97 81.92,100.33 84.45,100.33 84.45,88.27 v83.19,88.27 | IC-SO7.8 v120.02,100.97 | IC-SO9.8 v158.12,100.97 | 22.23,103.5 24.13,104.78 24.13,114.3 | SW-36.SB 99.69,119.38 99.69,120.02 96.52,123.19 95.89,123.19 95.89,147.32 97.16,146.69 97.16,146.05 | SW-38.SB 137.79,119.38 134.62,123.19 133.99,123.19 133.99,147.32 135.25,146.69 | SW-40.SB 175.9,119.38 172.72,123.19 172.09,123.19 172.09,147.32 173.35,146.69 | SW-34.SB 61.59,119.38 57.78,123.19 57.78,147.32 59.05,146.69 | 52.07,83.82 52.07,86.36 | 57.15,170.18 57.15,165.74 v56.52,165.74 | 27.3,96.52 27.94,96.52 | v177.04,64.52 176.28,64.77
  other vias: 1.27,95.89 34.92,95.89 34.92,95.89 6.99,88.27 73.03,95.89 73.03,95.89 111.12,95.89 111.12,95.89 93.34,103.5 149.22,95.89 149.22,95.89 121.28,88.27 187.32,95.89 187.32,95.89 159.38,88.27 138.43,191.77 176.53,191.77
  pour Bottom (isolate 0.61): 0,196.85 190.5,196.85 190.5,0 0,0
IO_CLOCK  (via drill 0.5 pad 0.25, 0.8 pad 1.68)
  Top 0.254: IC-SI1.2 13.34,100.33 15.88,100.33 15.88,97.79 18.41,97.79 v19.05,97.16 29.21,97.16 IC-SI2.2 29.21,100.33 30.48,100.97 31.75,100.97 32.38,101.6 33.02,101.6 v34.92,103.5 v39.37,103.5 39.37,106.68 v43.81,106.68 | v1.27,103.5 1.27,106.36 v6.99,106.36 | IC-SI3.2 51.44,100.33 53.98,100.33 53.98,97.79 56.52,97.79 v57.15,97.16 67.31,97.16 IC-SI4.2 67.31,100.33 68.58,100.97 69.85,100.97 70.48,101.6 71.12,101.6 v73.03,103.5 v77.47,103.5 77.47,106.68 v81.92,106.68 | IC-SI5.2 89.53,100.33 92.08,100.33 92.08,97.79 94.61,97.79 v95.25,97.16 105.41,97.16 IC-SI6.2 105.41,100.33 106.68,100.97 107.95,100.97 108.58,101.6 109.22,101.6 v111.12,103.5 v115.57,103.5 115.57,106.68 v120.02,106.68 | IC-SI7.2 127.64,100.33 130.18,100.33 130.18,97.79 132.72,97.79 v133.35,97.16 143.51,97.16 IC-SI8.2 143.51,100.33 144.78,100.97 146.05,100.97 146.69,101.6 147.32,101.6 v149.22,103.5 v153.67,103.5 153.67,106.68 158.12,106.68 v158.12,107.95 | IC-SI9.2 165.74,100.33 168.28,100.33 168.28,97.79 170.81,97.79 v171.45,97.16 181.61,97.16 IC-SI10.2 181.61,100.33 182.88,100.97 184.15,100.97 184.78,101.6 185.42,101.6 v187.32,103.5
  Bottom 0.254: v19.05,97.16 20.32,95.89 20.32,94.61 20.95,93.98 IC-SO2.11 | v19.05,97.16 19.05,111.76 8.26,111.76 8.26,107.31 v6.99,106.36 | IC-SO1.11 13.97,97.79 15.24,97.16 v19.05,97.16 | v57.15,97.16 58.42,95.89 58.42,94.61 59.05,93.98 IC-SO4.11 | v57.15,97.16 57.15,112.39 48.26,112.39 46.35,107.31 v43.81,106.68 | IC-SO3.11 52.07,97.79 53.34,97.16 v57.15,97.16 | v95.25,97.16 96.52,95.89 96.52,94.61 97.16,93.98 IC-SO6.11 | v95.25,97.16 95.25,112.39 85.72,112.39 84.45,107.31 v81.92,106.68 | IC-SO5.11 90.17,97.79 91.44,97.16 v95.25,97.16 | v133.35,97.16 134.62,95.89 134.62,94.61 135.25,93.98 IC-SO8.11 | v133.35,97.16 133.35,112.39 123.83,112.39 122.56,107.31 v120.02,106.68 | IC-SO7.11 128.27,97.79 129.54,97.16 v133.35,97.16 | v171.45,97.16 172.72,95.89 172.72,94.61 173.35,93.98 IC-SO10.11 | v171.45,97.16 171.45,114.94 161.29,114.94 160.66,113.67 158.12,113.67 v158.12,107.95 | IC-SO9.11 166.37,97.79 167.64,97.16 v171.45,97.16
L1
  Bottom 0.254: R1.2 SW-1.L+
L2
  Top 0.254: R2.2 SW-2.L+
L3
  Bottom 0.254: R3.2 SW-3.L+
L4
  Top 0.254: R4.2 SW-4.L+
L5
  Bottom 0.254: R5.2 SW-5.L+
L6
  Top 0.254: R6.2 SW-6.L+
L7
  Bottom 0.254: R7.2 SW-7.L+
L8
  Top 0.254: R8.2 SW-8.L+
L9
  Bottom 0.254: R9.2 SW-9.L+
L10
  Top 0.254: R10.2 SW-10.L+
L11
  Bottom 0.254: R11.2 SW-11.L+
L12
  Bottom 0.254: R12.2 SW-12.L+
L13
  Bottom 0.254: R13.2 SW-13.L+
L14
  Top 0.254: R14.2 62.87,165.74 SW-14.L+
L15
  Bottom 0.254: R15.2 SW-15.L+
L16
  Bottom 0.254: R16.2 SW-16.L+
L17
  Bottom 0.254: R17.2 SW-17.L+
L18
  Bottom 0.254: R18.2 SW-18.L+
L19
  Bottom 0.254: R19.2 SW-19.L+
L20
  Bottom 0.254: R20.2 SW-20.L+
L21
  Top 0.254: R21.2 SW-21.L+
L22
  Top 0.254: R22.2 SW-22.L+
L23
  Top 0.254: R23.2 SW-23.L+
L24
  Top 0.254: R24.2 SW-24.L+
L25
  Top 0.254: R25.2 SW-25.L+
L26
  Top 0.254: R26.2 SW-26.L+
L27
  Top 0.254: R27.2 SW-27.L+
L28
  Top 0.254: R28.2 SW-28.L+
L29
  Top 0.254: R29.2 SW-29.L+
L30
  Top 0.254: R30.2 SW-30.L+
L31  (via drill 0.6)
  Top 0.254: v2.54,129.54 1.27,129.54 R31.2
  Bottom 0.254: v2.54,129.54 SW-31.L+
L32
  Bottom 0.254: R32.2 SW-32.L+
L33
  Bottom 0.254: R33.2 43.18,127 43.81,127.64 SW-33.L+
L34
  Bottom 0.254: R34.2 SW-34.L+
L35
  Top 0.254: R35.2 78.11,128.91 78.74,129.54 SW-35.L+
L36
  Bottom 0.254: R36.2 SW-36.L+
L37
  Top 0.254: R37.2 120.02,127 SW-37.L+
L38
  Bottom 0.254: R38.2 SW-38.L+
L39
  Top 0.254: R39.2 157.48,127 158.12,127.64 SW-39.L+
L40
  Bottom 0.254: R40.2 SW-40.L+
L41
  Bottom 0.254: R41.2 1.91,71.75 SW-41.L+
L42
  Bottom 0.254: R42.2 20.95,71.75 SW-42.L+
L43
  Bottom 0.254: R43.2 40.01,71.75 SW-43.L+
L44
  Bottom 0.254: R44.2 59.05,71.75 SW-44.L+
L45
  Bottom 0.254: R45.2 78.11,71.75 SW-45.L+
L46
  Top 0.254: R46.2 97.16,71.75 SW-46.L+
L47
  Bottom 0.254: R47.2 116.2,71.75 SW-47.L+
L48
  Bottom 0.254: R48.2 135.25,71.75 SW-48.L+
L49
  Bottom 0.254: R49.2 154.31,71.75 SW-49.L+
L50
  Bottom 0.254: R50.2 173.35,71.75 SW-50.L+
L51
  Bottom 0.254: R51.2 SW-51.L+
L52
  Bottom 0.254: R52.2 SW-52.L+
L53
  Bottom 0.254: R53.2 SW-53.L+
L54
  Bottom 0.254: R54.2 SW-54.L+
L55
  Bottom 0.254: R55.2 SW-55.L+
L56
  Bottom 0.254: R56.2 SW-56.L+
L57
  Bottom 0.254: R57.2 SW-57.L+
L58
  Bottom 0.254: R58.2 SW-58.L+
L59
  Bottom 0.254: R59.2 SW-59.L+
L60
  Bottom 0.254: R60.2 SW-60.L+
L61
  Bottom 0.254: R61.2 SW-61.L+
L62
  Bottom 0.254: R62.2 SW-62.L+
L63
  Bottom 0.254: R63.2 SW-63.L+
L64
  Bottom 0.254: R64.2 SW-64.L+
L65
  Bottom 0.254: R65.2 SW-65.L+
L66
  Bottom 0.254: R66.2 SW-66.L+
L67
  Bottom 0.254: R67.2 SW-67.L+
L68
  Bottom 0.254: R68.2 SW-68.L+
L69
  Bottom 0.254: R69.2 SW-69.L+
L70
  Bottom 0.254: R70.2 SW-70.L+
L71
  Bottom 0.254: R71.2 SW-71.L+
L72
  Bottom 0.254: R72.2 SW-72.L+
L73
  Bottom 0.254: R73.2 SW-73.L+
L74
  Bottom 0.254: R74.2 SW-74.L+
L75
  Bottom 0.254: R75.2 SW-75.L+
L76
  Bottom 0.254: R76.2 SW-76.L+
L77
  Bottom 0.254: R77.2 SW-77.L+
L78
  Bottom 0.254: R78.2 SW-78.L+
L79
  Bottom 0.254: R79.2 SW-79.L+
L80
  Bottom 0.254: R80.2 SW-80.L+
LED1_OUT  (via drill 0.6)
  Top 0.254: v17.14,99.06 19.68,99.06 v20.32,98.42
  Bottom 0.254: IC-SO2.14 20.95,97.79 v20.32,98.42 | v17.14,99.06 17.14,100.33 IC-SO1.9
LED2_OUT  (via drill 0.5 pad 0.25, 0.8 pad 1.68)
  Top 0.254: v18.41,74.3 19.05,74.3 19.05,75.56 19.68,80.01 19.68,83.19 19.05,83.82 v19.05,91.44 | v33.66,73.03 27.3,73.03 27.3,73.66 v24.77,73.66 | v34.29,83.82 33.66,84.45 33.66,87 v34.92,88.27 v39.37,88.27 41.91,88.27 41.91,94.61 44.45,94.61 44.45,95.25 48.9,95.25 v48.9,95.89
  Bottom 0.254: v19.05,91.44 IC-SO2.9 | v24.77,73.66 18.41,73.66 v18.41,74.3 | v34.29,83.82 33.66,82.55 v33.66,73.03 | IC-SO3.14 48.9,93.98 v48.9,95.89
LED3_OUT  (via drill 0.6)
  Top 0.254: v55.24,99.06 57.78,99.06 v58.42,98.42
  Bottom 0.254: IC-SO4.14 59.05,97.79 v58.42,98.42 | v55.24,99.06 55.24,100.33 IC-SO3.9
LED4_OUT  (via drill 0.5 pad 0.25, 0.8 pad 1.68)
  Top 0.254: v56.52,74.3 57.15,74.3 v57.15,91.44 | v71.75,75.95 71.75,76.2 65.41,76.2 65.41,73.66 v62.87,73.66 | v71.75,84.45 71.75,87 v73.03,88.27 v77.47,88.27 80.01,88.27 80.01,94.61 82.55,94.61 82.55,95.25 87,95.25 v87,95.89
  Bottom 0.254: v57.15,91.44 IC-SO4.9 | v62.87,73.66 56.52,73.66 v56.52,74.3 | v71.75,84.45 v71.75,75.95 | IC-SO5.14 87,93.98 v87,95.89
LED5_OUT  (via drill 0.6)
  Top 0.254: v93.34,99.06 95.89,99.06 v96.52,98.42
  Bottom 0.254: IC-SO6.14 97.16,97.79 v96.52,98.42 | v93.34,99.06 93.34,100.33 IC-SO5.9
LED6_OUT  (via drill 0.5 pad 0.25, 0.8 pad 1.68)
  Top 0.254: v94.61,74.3 95.25,74.3 v95.25,91.44 | v109.86,84.45 109.86,87 v111.12,88.27 v115.57,88.27 118.11,88.27 118.11,94.61 120.65,94.61 120.65,95.25 125.09,95.25 v125.09,95.89 | v109.86,79.38 103.5,79.38 103.5,73.66 v97.79,73.66
  Bottom 0.254: v95.25,91.44 IC-SO6.9 | v97.79,73.66 94.61,73.66 v94.61,74.3 | v109.86,84.45 v109.86,79.38 | IC-SO7.14 125.09,93.98 v125.09,95.89
LED7_OUT  (via drill 0.6)
  Top 0.254: v131.44,99.06 133.99,99.06 v134.62,98.42
  Bottom 0.254: IC-SO8.14 135.25,97.79 v134.62,98.42 | v131.44,99.06 131.44,100.33 IC-SO7.9
LED8_OUT  (via drill 0.5 pad 0.25, 0.8 pad 1.68)
  Top 0.254: v132.72,74.3 133.35,74.3 v133.35,91.44 | v139.06,73.66 140.97,73.66 140.97,73.03 v147.96,73.03 | v147.96,84.45 147.96,87 v149.22,88.27 v153.67,88.27 156.21,88.27 156.21,94.61 158.75,94.61 158.75,95.25 163.19,95.25 v163.19,95.89
  Bottom 0.254: v133.35,91.44 IC-SO8.9 | v139.06,73.66 132.72,73.66 v132.72,74.3 | v147.96,84.45 v147.96,73.03 | IC-SO9.14 163.19,93.98 v163.19,95.89
LED9_OUT  (via drill 0.6)
  Top 0.254: v169.54,99.06 172.09,99.06 v172.72,98.42
  Bottom 0.254: IC-SO10.14 173.35,97.79 v172.72,98.42 | v169.54,99.06 169.54,100.33 IC-SO9.9
LED10_OUT  (via drill 0.5 pad 0.25, 0.8 pad 1.68)
  Top 0.254: v170.81,74.3 171.45,74.3 v171.45,91.44 | v177.16,73.66 178.44,73.66 178.44,73.03 v186.06,73.03 | v187.32,78.11 186.06,78.11 186.06,87 v187.32,88.27
  Bottom 0.254: v171.45,91.44 IC-SO10.9 | v177.16,73.66 170.81,73.66 v170.81,74.3 | v187.32,78.11 186.69,78.11 186.69,73.03 v186.06,73.03
LED_DATA  (via drill 0.5 pad 0.25, 0.8 pad 1.68)
  Top 0.254: v1.27,88.27 3.81,88.27 3.81,94.61 6.35,94.61 6.35,95.25 10.79,95.25 v10.79,95.89
  Bottom 0.254: IC-SO1.14 10.79,93.98 v10.79,95.89
LED_LATCH  (via drill 0.5 pad 0.25, 0.8 pad 1.68)
  Top 0.254: v26.04,95.57 27.3,95.25 33.66,95.25 33.66,90.81 v34.92,90.81 v39.37,90.81 40.01,90.81 41.27,92.08 41.27,95.25 43.81,95.25 43.81,95.89 47.62,95.89 47.62,96.52 v48.9,97.16 | v1.27,90.81 1.91,90.81 3.17,92.08 3.17,95.25 5.71,95.25 5.71,95.89 9.53,95.89 9.53,96.52 v10.79,97.16 | 79.38,94.61 69.85,94.61 69.85,95.25 64.77,95.25 v64.77,95.57 | v102.87,95.57 102.87,95.25 109.86,95.25 109.86,90.81 v111.12,90.81 v115.57,90.81 116.2,90.81 117.47,92.08 117.47,95.25 120.02,95.25 120.02,95.89 123.83,95.89 123.83,96.52 v125.09,97.16 | v77.47,90.81 78.11,90.81 79.38,92.08 79.38,94.61 | 79.38,94.61 79.38,95.25 81.92,95.25 81.92,95.89 85.72,95.89 85.72,96.52 v87,97.16 | v140.97,95.57 140.97,95.25 147.96,95.25 147.96,90.81 v149.22,90.81 v153.67,90.81 154.31,90.81 155.57,92.08 155.57,95.25 158.12,95.25 158.12,95.89 161.93,95.89 161.93,96.52 v163.19,97.16 | v179.07,95.57 179.07,95.25 186.06,95.25 186.06,90.81 v187.32,90.81
  Bottom 0.254: IC-SO2.12 26.04,95.25 v26.04,95.57 26.04,90.17 19.05,90.17 17.78,91.44 16.51,93.34 16.51,95.89 13.97,96.52 IC-SO1.12 v10.79,97.16 | IC-SO4.12 62.87,95.25 63.5,95.89 64.77,95.89 v64.77,95.57 64.77,93.34 63.5,93.34 63.5,90.17 57.15,90.17 55.88,91.44 54.61,93.34 54.61,96.52 IC-SO3.12 v48.9,97.16 | IC-SO6.12 100.97,95.25 101.6,95.89 102.87,95.89 v102.87,95.57 102.87,90.17 95.25,90.17 93.98,91.44 92.71,93.34 92.71,95.89 90.17,96.52 IC-SO5.12 v87,97.16 | IC-SO8.12 139.06,95.25 139.7,95.89 140.97,95.89 v140.97,95.57 140.97,90.17 133.35,90.17 132.08,91.44 130.81,93.34 130.81,95.89 128.27,96.52 IC-SO7.12 v125.09,97.16 | IC-SO10.12 177.16,95.25 177.8,95.89 179.07,95.89 v179.07,95.57 179.07,90.17 171.45,90.17 170.18,91.44 168.91,93.34 168.91,95.89 166.37,96.52 IC-SO9.12 v163.19,97.16 | v73.03,90.81 v77.47,90.81
MIDI_RX  (via drill 0.6)
  Top 0.254: 280.1 60.33,170.81 v59.69,170.81 v62.87,170.81 | J10.1 64.77,87.63 64.77,81.28 72.39,81.28 v73.03,81.92 | v74.3,111.12 74.3,111.76 75.56,112.39 75.56,169.54 v73.66,173.35 | v75.56,95.89 v75.56,99.69 | v67.31,170.81 68.58,172.09 v68.58,173.35
  Bottom 0.254: v74.3,111.12 75.56,106.68 v75.56,99.69 | v75.56,95.89 76.83,94.61 78.11,94.61 80.01,92.71 80.01,85.09 78.74,85.09 75.56,81.92 v73.03,81.92 | v67.31,170.81 v62.87,170.81 | v73.66,173.35 v68.58,173.35 | PC900.4 v59.69,170.81
MIDI_RX4
  Top 0.254: RX_220.2 48.9,193.04 57.15,193.04 J2.3
MIDI_RX5
  Bottom 0.254: J2.2 54.61,193.04 56.52,193.04 56.52,182.25 D1.A 56.52,179.71 56.72,179.71 PC900.2
MIDI_TX  (via drill 0.5 pad 0.25, 0.6)
  Top 0.254: J10.2 v71.75,92.08 | v71.75,113.67 v67.31,113.67
  Bottom 0.254: v67.31,113.67 54.61,113.67 54.61,120.65 57.15,122.56 57.15,164.47 61.59,164.47 61.59,172.09 57.15,172.09 57.15,177.8 58.42,177.8 58.42,180.34 57.15,180.97 57.15,191.13 60.33,191.13 60.33,191.77 72.39,191.77 TX_220_2.1 | v71.75,92.08 71.12,92.71 71.12,113.03 v71.75,113.67
MIDI_TX_4
  Bottom 0.254: TX_220_1.1 J2.5
MIDI_TX_5
  Bottom 0.254: TX_220_2.2 59.69,193.04 J2.4
N$1  (via drill 0.8 pad 1.68)
  other vias: 39.37,98.42
N$2  (via drill 0.8 pad 1.68)
  other vias: 34.92,98.42
N$3  (via drill 0.8 pad 1.68)
  other vias: 1.27,98.42
N$4  (via drill 0.8 pad 1.68)
  other vias: 73.03,98.42
N$5  (via drill 0.8 pad 1.68)
  other vias: 77.47,98.42
N$6  (via drill 0.8 pad 1.68)
  other vias: 111.12,98.42
N$7  (via drill 0.8 pad 1.68)
  other vias: 115.57,98.42
N$8  (via drill 0.8 pad 1.68)
  other vias: 149.22,98.42
N$9  (via drill 0.8 pad 1.68)
  other vias: 153.67,98.42
N$10  (via drill 0.8 pad 1.68)
  other vias: 187.32,98.42
R1
  Bottom 0.254: R1.1 1.91,173.35 4.45,170.81 11.43,170.81 11.43,172.09 17.78,172.09 17.78,125.09 15.24,122.56 15.24,118.11 9.53,118.11 7.62,114.3 4.45,114.3 4.45,113.03 2.54,113.03 2.54,106.68 4.45,106.68 4.45,99.69 5.08,99.06 IC-SO1.7
R2
  Bottom 0.254: IC-SO2.3 32.38,97.79 32.38,111.76 36.2,114.3 36.2,190.5 34.92,191.13 30.48,191.13 30.48,189.23 22.86,189.23 22.86,185.42 20.95,183.51 R2.1
R3
  Bottom 0.254: R3.1 40.01,173.35 42.55,170.81 49.53,170.81 49.53,172.09 52.7,172.09 52.7,169.54 53.34,168.91 53.34,164.47 56.52,164.47 56.52,125.73 53.34,122.56 53.34,118.11 47.62,118.11 45.72,114.3 42.55,114.3 42.55,99.69 43.18,99.06 IC-SO3.7
R4
  Bottom 0.254: IC-SO4.3 70.48,97.79 70.48,114.94 74.3,116.84 74.3,154.94 74.93,155.57 74.93,191.13 60.96,191.13 60.96,185.42 59.05,183.51 R4.1
R5
  Bottom 0.254: R5.1 78.11,173.35 80.64,170.81 87.63,170.81 87.63,172.72 93.98,172.72 93.98,125.09 91.44,122.56 91.44,118.11 85.72,118.11 83.82,114.3 80.64,114.3 80.64,99.69 81.28,99.06 IC-SO5.7
R6
  Bottom 0.254: IC-SO6.3 108.58,97.79 108.58,111.76 112.39,114.3 112.39,155.57 113.03,155.57 113.03,189.23 111.12,191.13 106.68,191.13 106.68,189.23 99.06,189.23 99.06,185.42 97.16,183.51 R6.1
R7
  Bottom 0.254: R7.1 116.2,173.35 118.75,170.81 125.73,170.81 125.73,172.72 132.08,172.72 132.08,125.09 129.54,122.56 129.54,115.57 124.46,115.57 121.92,114.3 118.75,114.3 118.75,99.69 119.38,99.06 IC-SO7.7
R8
  Bottom 0.254: IC-SO8.3 146.69,97.79 146.69,111.76 150.5,113.03 150.5,155.57 151.13,155.57 151.13,189.23 149.22,191.13 144.78,191.13 144.78,189.23 137.16,189.23 137.16,185.42 135.25,183.51 R8.1
R9
  Bottom 0.254: R9.1 154.31,173.35 156.84,170.81 163.83,170.81 163.83,172.72 170.18,172.72 170.18,125.09 167.64,122.56 167.64,118.11 161.93,118.11 160.02,114.3 156.84,114.3 156.84,99.69 157.48,99.06 IC-SO9.7
R10  (via drill 0.6)
  Top 0.254: v182.88,191.13 v188.59,191.13
  Bottom 0.254: IC-SO10.3 184.78,97.79 184.78,107.31 189.23,109.86 189.23,190.5 v188.59,191.13 | R10.1 173.35,183.51 175.26,185.42 175.26,189.23 182.88,189.23 v182.88,191.13
R11
  Bottom 0.254: R11.1 1.27,161.29 2.54,160.02 2.54,154.31 4.45,152.4 4.45,146.05 6.99,146.05 6.99,140.34 10.16,140.34 10.16,131.44 12.06,129.54 12.06,123.19 10.16,121.28 9.53,119.38 6.99,114.94 3.81,114.94 3.81,113.67 1.91,113.67 1.91,106.05 3.81,106.05 3.81,99.06 5.08,97.79 IC-SO1.6
R12
  Bottom 0.254: R12.1 21.59,162.56 21.59,154.31 23.5,152.4 23.5,146.05 26.04,146.05 26.04,140.34 29.21,140.34 29.21,136.53 35.56,136.53 35.56,114.94 31.75,112.39 31.75,99.06 IC-SO2.2
R13
  Bottom 0.254: R13.1 40.01,154.31 42.55,152.4 42.55,146.05 45.09,146.05 45.09,140.34 48.26,140.34 48.26,131.44 50.16,129.54 50.16,123.19 48.26,121.28 45.09,114.94 41.91,114.94 41.91,99.06 43.18,97.79 IC-SO3.6
R14
  Bottom 0.254: R14.1 59.69,160.66 59.69,154.31 61.59,152.4 61.59,146.05 64.14,146.05 64.14,140.34 67.31,140.34 67.31,136.53 73.66,136.53 73.66,117.47 69.85,115.57 69.85,99.06 IC-SO4.2
R15
  Bottom 0.254: R15.1 78.11,154.31 80.64,152.4 80.64,146.05 83.19,146.05 83.19,140.34 86.36,140.34 86.36,131.44 88.34,129.54 88.34,123.19 85.09,118.75 83.19,114.94 80.01,114.94 80.01,99.06 81.28,97.79 IC-SO5.6
R16
  Bottom 0.254: R16.1 97.79,162.56 97.79,154.31 99.69,152.4 99.69,146.05 102.23,146.05 102.23,140.34 105.41,140.34 105.41,136.53 111.76,136.53 111.76,114.94 107.95,112.39 107.95,99.06 IC-SO6.2
R17
  Bottom 0.254: R17.1 116.2,154.31 118.75,152.4 118.75,146.05 121.28,146.05 121.28,140.34 124.46,140.34 124.46,131.44 126.44,129.54 126.44,123.19 124.46,120.02 124.46,116.84 121.28,114.94 118.11,114.94 118.11,99.06 119.38,97.79 IC-SO7.6
R18
  Bottom 0.254: R18.1 135.89,162.56 135.89,154.31 137.79,152.4 137.79,146.05 140.34,146.05 140.34,140.34 143.51,140.34 143.51,136.53 149.86,136.53 149.86,113.67 146.05,112.39 146.05,99.06 IC-SO8.2
R19
  Bottom 0.254: R19.1 154.31,154.31 156.84,152.4 156.84,146.05 159.38,146.05 159.38,140.34 162.56,140.34 162.56,131.44 164.47,129.54 164.47,123.19 162.56,121.28 159.38,114.94 156.21,114.94 156.21,99.06 157.48,97.79 IC-SO9.6
R20
  Bottom 0.254: R20.1 173.99,162.56 173.99,154.31 175.9,152.4 175.9,146.05 178.44,146.05 178.44,140.34 181.61,140.34 181.61,136.53 188.59,136.53 188.59,110.49 184.15,107.95 184.15,99.06 IC-SO10.2
R21
  Bottom 0.254: R21.1 2.54,143.51 2.54,135.89 6.99,131.44 6.99,123.19 3.17,119.38 3.17,114.3 1.27,114.3 1.27,105.41 3.17,105.41 3.17,98.42 5.08,96.52 IC-SO1.5
R22
  Bottom 0.254: IC-SO2.1 30.48,100.33 30.48,103.5 29.21,104.78 26.67,104.78 26.67,111.76 28.57,111.76 28.57,121.28 27.94,121.28 26.04,123.19 26.04,131.44 20.32,131.44 20.32,143.51 R22.1
R23
  Bottom 0.254: R23.1 40.64,143.51 40.64,135.89 45.09,131.44 45.09,123.19 41.27,119.38 41.27,98.42 43.18,96.52 IC-SO3.5
R24
  Bottom 0.254: IC-SO4.1 68.58,100.33 68.58,103.5 67.31,104.78 67.31,111.76 69.22,111.76 69.22,115.57 66.67,115.57 66.67,121.28 66.04,121.28 64.14,123.19 64.14,131.44 58.42,131.44 58.42,143.51 R24.1
R25
  Bottom 0.254: R25.1 78.74,143.51 78.74,135.89 79.38,131.44 79.38,126.36 78.74,123.83 79.38,122.56 79.38,98.42 81.28,96.52 IC-SO5.5
R26
  Bottom 0.254: IC-SO6.1 106.68,100.33 106.68,103.5 105.41,104.78 102.87,104.78 102.87,111.76 104.78,111.76 104.78,121.28 104.14,121.28 102.23,123.19 102.23,131.44 96.52,131.44 96.52,143.51 R26.1
R27
  Bottom 0.254: R27.1 116.2,129.54 118.11,129.54 118.11,126.36 116.84,124.46 116.84,121.92 117.47,121.28 117.47,98.42 119.38,96.52 IC-SO7.5
R28
  Bottom 0.254: IC-SO8.1 144.78,100.33 144.78,103.5 143.51,104.78 140.97,104.78 140.97,111.76 142.88,111.76 142.88,121.28 142.24,121.28 140.34,123.19 140.34,131.44 134.62,131.44 134.62,143.51 R28.1
R29
  Bottom 0.254: R29.1 154.31,128.27 155.57,126.36 154.94,122.56 155.57,121.28 155.57,98.42 157.48,96.52 IC-SO9.5
R30
  Bottom 0.254: IC-SO10.1 182.88,100.33 182.88,103.5 181.61,104.78 179.07,104.78 177.8,106.05 177.8,109.86 179.07,110.49 179.07,114.3 180.97,114.3 180.97,121.28 180.34,121.28 178.44,123.19 178.44,131.44 172.72,131.44 172.72,143.51 R30.1
R31
  Bottom 0.254: R31.1 2.54,120.65 2.54,114.94 0.64,114.94 0.64,104.78 2.54,104.78 2.54,97.79 5.08,95.25 IC-SO1.4
R32
  Bottom 0.254: IC-SO2.15 21.59,99.06 19.68,99.69 19.68,104.78 21.59,104.78 21.59,111.76 22.23,111.76 22.23,122.56 21.59,123.19 R32.1
R33
  Bottom 0.254: R33.1 40.64,120.65 40.64,97.79 43.18,95.25 IC-SO3.4
R34
  Bottom 0.254: IC-SO4.15 59.69,99.06 57.78,99.69 57.78,104.78 62.23,104.78 62.23,112.39 68.58,112.39 68.58,114.94 66.04,114.94 66.04,120.02 63.5,122.56 60.33,122.56 59.69,123.19 R34.1
R35
  Bottom 0.254: R35.1 78.74,120.65 78.74,97.79 81.28,95.25 IC-SO5.4
R36
  Bottom 0.254: IC-SO6.15 97.79,99.06 95.89,99.69 95.89,104.78 100.33,104.78 100.33,112.39 104.14,112.39 104.14,120.02 101.6,122.56 98.42,122.56 97.79,123.19 R36.1
R37
  Bottom 0.254: R37.1 116.84,120.65 116.84,97.79 119.38,95.25 IC-SO7.4
R38
  Bottom 0.254: IC-SO8.15 135.89,99.06 133.99,99.69 133.99,104.78 138.43,104.78 138.43,112.39 142.24,112.39 142.24,120.02 139.7,122.56 136.53,122.56 135.89,123.19 R38.1
R39
  Bottom 0.254: R39.1 154.94,120.65 154.94,97.79 157.48,95.25 IC-SO9.4
R40
  Bottom 0.254: IC-SO10.15 173.99,99.06 172.09,99.69 172.09,104.78 176.53,104.78 176.53,114.94 180.34,114.94 180.34,120.02 177.8,122.56 174.62,122.56 173.99,123.19 R40.1
R41
  Bottom 0.254: IC-SO1.3 4.45,93.98 4.45,85.72 3.81,85.09 1.27,83.82 1.27,76.83 R41.1
R42
  Bottom 0.254: R42.1 25.4,74.93 28.57,80.64 28.57,83.19 29.21,83.19 29.21,87.63 31.11,87.63 31.75,88.9 31.75,92.71 IC-SO2.7
R43
  Bottom 0.254: IC-SO3.3 42.55,93.98 42.55,74.93 R43.1
R44
  Bottom 0.254: R44.1 63.5,74.93 66.67,80.01 66.67,83.19 64.77,83.19 64.77,86.36 64.14,87 64.14,92.71 IC-SO4.7
R45
  Bottom 0.254: IC-SO5.3 80.64,93.98 80.64,74.93 R45.1
R46
  Bottom 0.254: R46.1 101.6,74.93 102.87,79.38 102.87,86.36 102.23,87 102.23,89.53 104.14,89.53 104.14,92.71 IC-SO6.7
R47
  Bottom 0.254: IC-SO7.3 118.75,93.98 118.75,74.93 R47.1
R48
  Bottom 0.254: R48.1 139.7,74.93 140.97,79.38 140.97,86.36 140.34,87 140.34,89.53 142.24,89.53 142.24,92.71 IC-SO8.7
R49
  Bottom 0.254: IC-SO9.3 156.84,93.98 156.84,74.93 R49.1
R50
  Bottom 0.254: R50.1 177.8,74.93 179.07,75.56 179.07,80.01 177.16,81.92 177.16,85.09 178.44,87 178.44,89.53 180.34,89.53 180.34,92.71 IC-SO10.7
R51
  Bottom 0.254: IC-SO1.2 5.08,92.71 5.08,85.09 2.54,82.55 2.54,77.47 5.08,73.66 6.99,73.66 6.99,65.41 5.71,64.14 1.91,64.14 R51.1
R52
  Bottom 0.254: R52.1 20.95,66.67 23.5,69.85 26.04,69.85 26.04,73.66 29.21,79.38 29.21,82.55 31.75,82.55 31.75,87.63 32.38,87.63 32.38,93.98 IC-SO2.6
R53
  Bottom 0.254: IC-SO3.2 43.18,92.71 43.18,73.66 45.09,73.66 45.09,65.41 43.81,64.14 40.01,64.14 R53.1
R54
  Bottom 0.254: R54.1 59.05,66.67 61.59,69.85 64.14,69.85 64.14,73.66 67.31,79.38 67.31,87 69.22,87 69.22,93.98 IC-SO4.6
R55
  Bottom 0.254: IC-SO5.2 81.28,92.71 81.28,73.66 83.19,73.66 83.19,65.41 81.92,64.14 78.11,64.14 R55.1
R56
  Bottom 0.254: R56.1 97.16,67.94 99.06,69.85 99.06,73.66 103.5,73.66 105.41,82.55 105.41,87 107.95,87 107.95,93.98 IC-SO6.6
R57
  Bottom 0.254: IC-SO7.2 119.38,92.71 119.38,73.66 121.28,73.66 121.28,65.41 120.02,64.14 116.2,64.14 R57.1
R58
  Bottom 0.254: R58.1 135.25,66.67 137.79,69.85 140.34,69.85 140.34,73.66 143.51,81.28 143.51,87 146.05,87 146.05,93.98 IC-SO8.6
R59
  Bottom 0.254: IC-SO9.2 157.48,92.71 157.48,73.66 159.38,73.66 159.38,65.41 158.12,64.14 154.31,64.14 R59.1
R60
  Bottom 0.254: R60.1 173.35,66.67 175.9,69.85 178.44,69.85 178.44,73.66 181.61,76.83 184.78,76.83 184.78,87 184.15,87 184.15,93.98 IC-SO10.6
R61
  Bottom 0.254: IC-SO1.1 5.71,91.44 5.71,85.09 6.35,84.45 7.62,82.55 7.62,81.28 6.99,80.01 5.71,79.38 5.71,74.3 8.26,74.3 8.26,72.39 12.06,72.39 12.06,65.41 10.16,63.5 10.16,55.88 6.99,52.7 6.99,46.35 5.71,45.09 1.91,45.09 R61.1
R62
  Bottom 0.254: R62.1 20.95,44.45 22.23,45.09 24.77,45.09 26.04,46.35 26.04,52.7 29.21,56.52 29.21,62.87 28.57,63.5 26.04,63.5 26.04,68.58 26.35,68.58 26.99,69.22 27.62,69.22 28.26,69.53 28.57,69.53 28.57,73.03 29.84,75.56 32.38,80.01 32.38,87 33.02,87 33.02,95.25 IC-SO2.5
R63
  Bottom 0.254: IC-SO3.1 43.81,91.44 43.81,74.3 46.35,74.3 46.35,72.39 50.16,72.39 50.16,65.41 48.26,63.5 48.26,55.88 45.09,52.7 45.09,46.35 43.81,45.09 40.01,45.09 R63.1
R64
  Bottom 0.254: R64.1 59.05,44.45 60.33,45.09 62.87,45.09 64.14,46.35 64.14,52.7 67.31,56.52 67.31,62.87 66.67,63.5 64.14,63.5 64.14,68.58 64.45,68.58 65.09,69.22 65.72,69.22 66.36,69.53 66.67,69.53 66.67,73.03 68.58,79.38 69.85,79.38 69.85,95.25 IC-SO4.5
R65
  Bottom 0.254: IC-SO5.1 81.92,91.44 81.92,74.3 84.45,74.3 84.45,72.39 88.27,72.39 88.27,65.41 86.36,63.5 86.36,55.88 83.19,52.7 83.19,46.35 81.92,45.09 78.11,45.09 R65.1
R66
  Bottom 0.254: R66.1 97.16,44.45 98.42,45.09 100.97,45.09 102.23,46.35 102.23,52.7 105.41,56.52 105.41,62.87 104.78,63.5 97.79,63.5 97.79,67.31 99.69,69.22 99.69,73.03 104.78,73.03 106.05,81.28 107.31,81.92 107.95,83.82 107.95,86.36 108.58,86.36 108.58,95.25 IC-SO6.5
R67
  Bottom 0.254: IC-SO7.1 120.02,91.44 120.02,74.3 122.56,74.3 122.56,72.39 126.36,72.39 126.36,65.41 124.46,63.5 124.46,55.88 121.28,52.7 121.28,46.35 120.02,45.09 116.2,45.09 R67.1
R68
  Bottom 0.254: R68.1 135.25,44.45 136.53,45.09 139.06,45.09 140.34,46.35 140.34,52.7 143.51,56.52 143.51,62.87 142.88,63.5 140.34,63.5 140.34,68.58 140.65,68.58 141.29,69.22 141.92,69.22 142.56,69.53 142.88,69.53 142.88,73.03 144.15,80.01 146.05,81.92 146.05,86.36 146.69,86.36 146.69,95.25 IC-SO8.5
R69
  Bottom 0.254: IC-SO9.1 158.12,91.44 158.12,74.3 160.66,74.3 160.66,72.39 164.47,72.39 164.47,65.41 162.56,63.5 162.56,55.88 159.38,52.7 159.38,46.35 158.12,45.09 154.31,45.09 R69.1
R70
  Bottom 0.254: R70.1 173.35,44.45 174.62,45.09 177.16,45.09 178.44,46.35 178.44,52.7 181.61,56.52 181.61,62.87 180.97,63.5 178.44,63.5 178.44,68.58 178.75,68.58 179.39,69.22 180.02,69.22 180.66,69.53 180.97,69.53 180.97,73.03 182.25,76.2 185.42,76.2 185.42,95.25 IC-SO10.5
R71  (via drill 0.5 pad 0.25, 0.6)
  Top 0.254: v11.43,81.28 11.43,74.93 9.53,73.66 3.81,73.66 3.81,68.58 2.54,67.94 2.54,63.5 11.43,63.5 v11.43,60.33
  Bottom 0.254: IC-SO1.15 13.97,92.71 14.61,91.44 13.97,90.17 13.34,89.53 11.43,89.53 v11.43,81.28 | R71.1 14.61,19.68 17.14,20.64 17.14,59.69 12.06,59.69 v11.43,60.33
R72
  Bottom 0.254: R72.1 33.66,19.68 36.2,20.95 36.2,69.22 31.11,69.22 31.11,75.56 33.02,79.38 33.02,85.09 33.66,87 33.66,96.52 IC-SO2.4
R73  (via drill 0.5 pad 0.25)
  Top 0.254: v49.53,74.93 47.62,73.66 38.1,73.66 38.1,63.5 49.53,63.5 v49.53,60.33
  Bottom 0.254: IC-SO3.15 52.07,92.71 52.7,91.44 52.07,90.17 51.44,89.53 49.53,89.53 v49.53,74.93 | R73.1 52.7,19.68 55.24,20.64 55.24,59.69 50.16,59.69 v49.53,60.33
R74
  Bottom 0.254: R74.1 71.75,19.68 74.3,20.95 74.3,69.22 69.22,69.22 69.22,75.56 70.48,75.56 70.48,96.52 IC-SO4.4
R75  (via drill 0.5 pad 0.25)
  Top 0.254: v87.63,74.93 85.72,73.66 76.83,73.66 76.83,63.5 87.63,63.5 v87.63,60.33
  Bottom 0.254: IC-SO5.15 90.17,92.71 90.81,91.44 90.17,90.17 89.53,89.53 87.63,89.53 v87.63,74.93 | R75.1 90.81,19.68 93.34,20.64 93.34,59.69 88.27,59.69 v87.63,60.33
R76
  Bottom 0.254: R76.1 109.86,19.68 112.39,20.95 112.39,69.22 107.31,69.22 107.31,80.01 108.58,81.92 108.58,85.09 109.86,87 109.86,96.52 IC-SO6.4
R77  (via drill 0.5 pad 0.25)
  Top 0.254: v125.73,74.93 123.83,73.66 114.94,73.66 114.94,63.5 125.73,63.5 v125.73,60.33
  Bottom 0.254: IC-SO7.15 128.27,92.71 128.91,91.44 128.27,90.17 127.64,89.53 125.73,89.53 v125.73,74.93 | R77.1 128.91,19.68 131.44,20.64 131.44,59.69 126.36,59.69 v125.73,60.33
R78
  Bottom 0.254: R78.1 147.96,19.68 150.5,20.95 150.5,69.22 145.41,69.22 145.41,79.38 146.69,80.64 146.69,85.09 147.96,87 147.96,96.52 IC-SO8.4
R79  (via drill 0.5 pad 0.25)
  Top 0.254: v163.83,73.66 153.03,73.66 153.03,63.5 163.83,63.5 v163.83,60.33
  Bottom 0.254: IC-SO9.15 166.37,92.71 167,91.44 166.37,90.17 165.74,89.53 163.83,89.53 v163.83,73.66 | R79.1 167,19.68 169.54,20.64 169.54,59.69 164.47,59.69 v163.83,60.33
R80
  Bottom 0.254: R80.1 186.06,19.68 188.59,20.95 188.59,80.01 186.06,80.01 186.06,96.52 IC-SO10.4
S1  (via drill 0.6)
  Top 0.254: SW-1.SA 13.34,179.07 17.14,176.53 17.14,160.66 15.88,160.66 15.88,155.26 v16.51,155.26 | 18.41,106.68 RN1.6 19.05,106.68 | IC-SI1.3 12.06,100.33 12.7,100.97 16.51,100.97 16.51,101.6 22.23,101.6 22.23,104.14 19.05,104.14 19.05,106.68 | 19.05,106.68 19.05,114.94 22.86,114.94 22.86,120.65 19.05,120.65 19.05,128.59 v16.51,128.59
  Bottom 0.254: v16.51,155.26 16.83,155.26 17.14,154.94 17.14,128.59 v16.51,128.59
S2
  Top 0.254: SW-2.SA 32.38,179.07 36.83,179.07 36.83,111.76 27.94,111.76 RN1.2 IC-SI2.3
S3  (via drill 0.6)